# Altium schematic sheet 3轴5.2-原理图-V3.3-2023.10.27.SchDoc
size A2
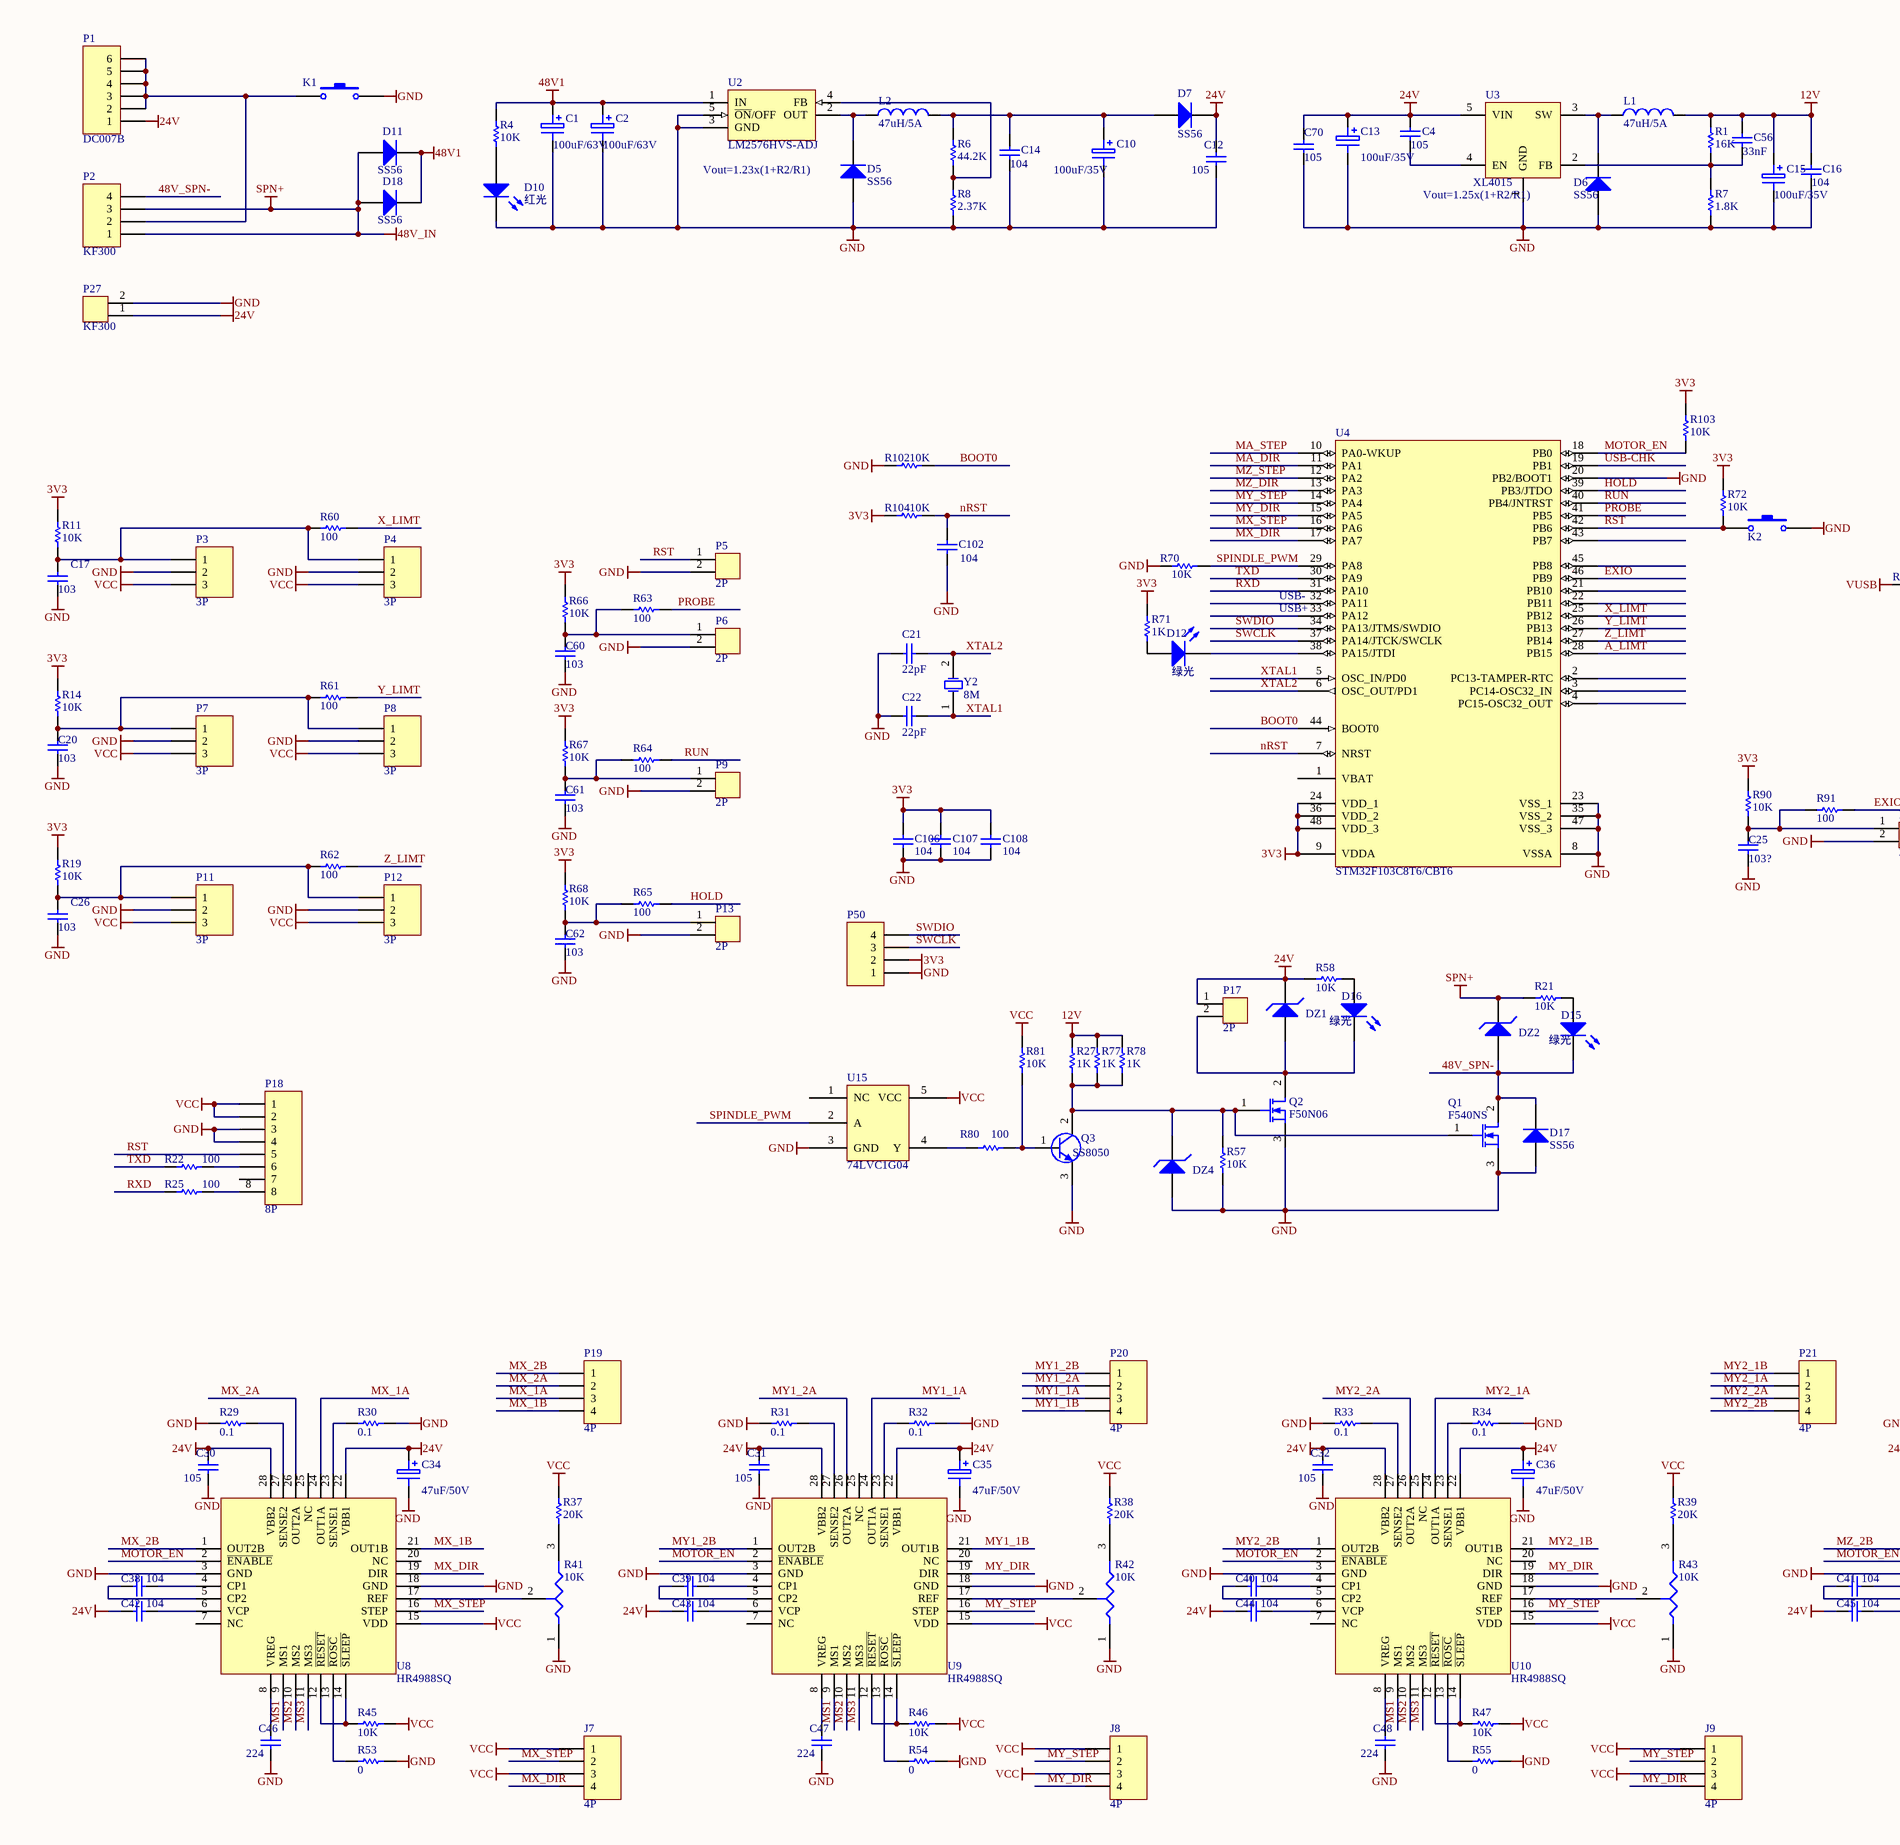
[diagram p0: 3轴5.2-原理图-V3.3-2023.10.27.SchDoc, left]
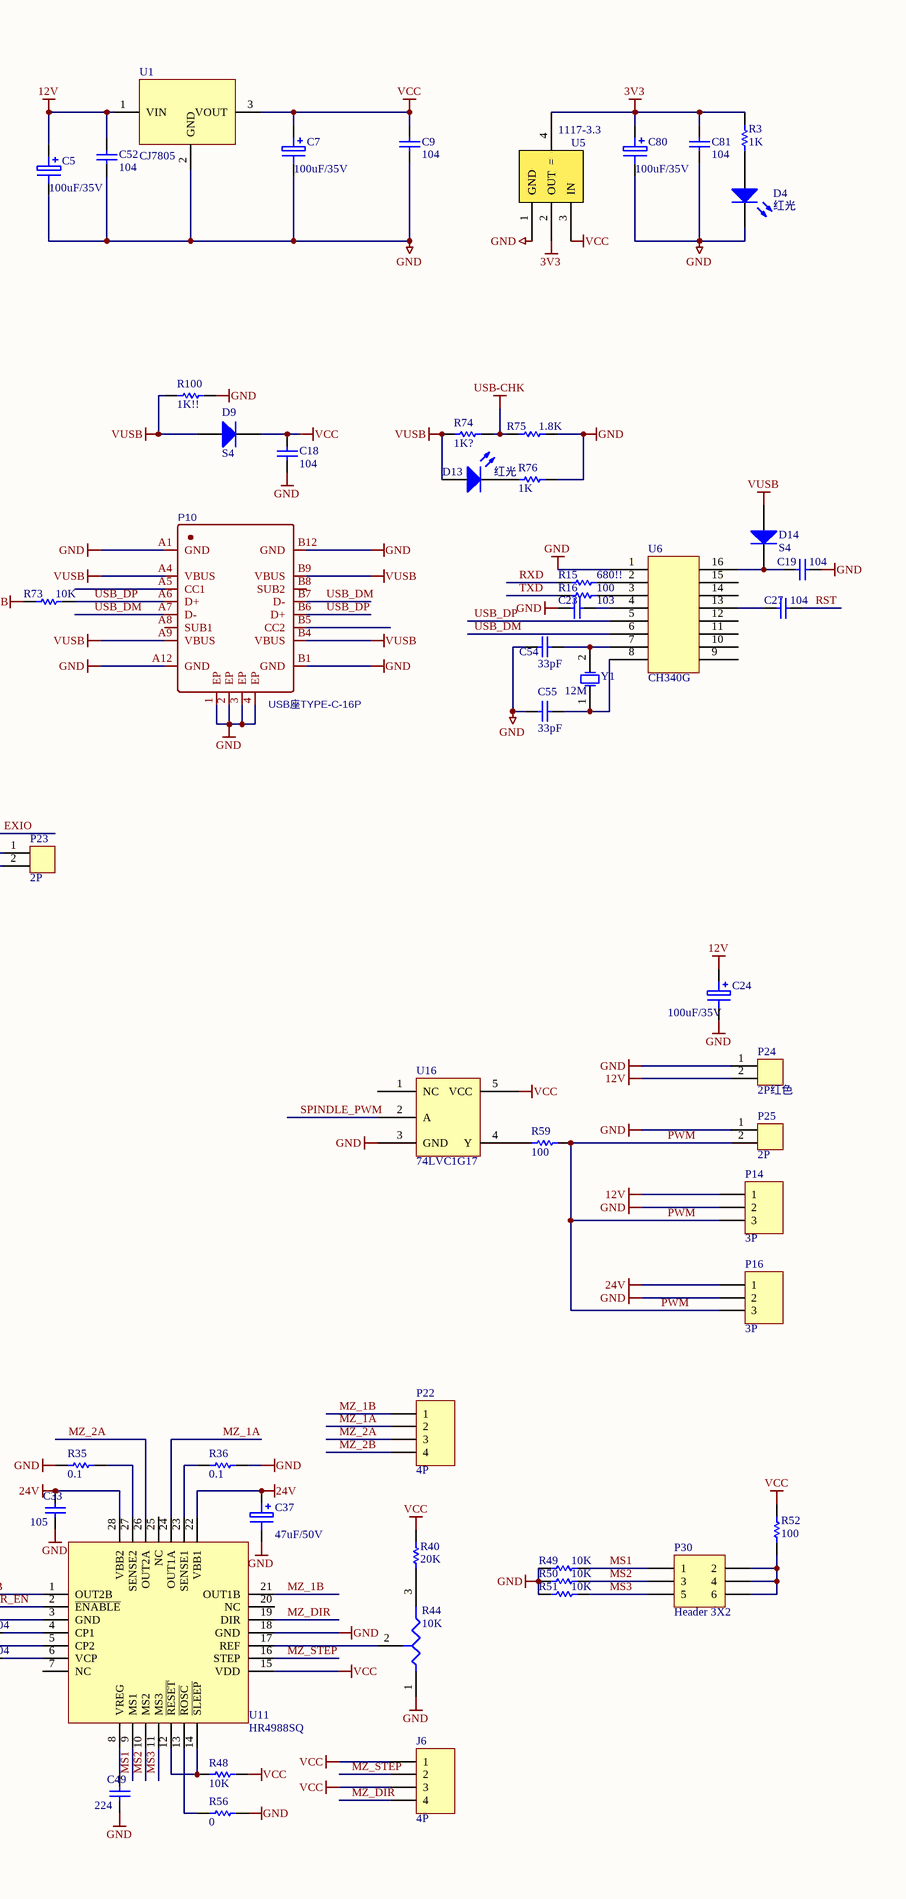
[diagram p1: 3轴5.2-原理图-V3.3-2023.10.27.SchDoc, right]

## Parts
C1  100uF/63V  [电解电容贴片10x10]
C2  100uF/63V  [电解电容贴片10x10]
C4  105  [0805C]
C5  100uF/35V  [电解电容贴片6x6]
C7  100uF/35V  [电解电容贴片6x6]
C9  104  [0603C]
C10  100uF/35V  [电解电容贴片6x6]
C12  105  [0805C]
C13  100uF/35V  [电解电容贴片6x6]
C14  104  [0603C]
C15  100uF/35V  [电解电容贴片6x6]
C16  104  [0603C]
C17  103  [0603C]
C18  104  [0603C]
C19  104  [0603C]
C20  103  [0603C]
C21  22pF  [0603C]
C22  22pF  [0603C]
C23  103  [0603C]
C24  100uF/35V  [电解电容贴片6x6]
C25  103?  [0603C]
C26  103  [0603C]
C27  104  [0603C]
C30  105  [0805C]
C31  105  [0805C]
C32  105  [0805C]
C33  105  [0805C]
C34  47uF/50V  [电解电容贴片6x6]
C35  47uF/50V  [电解电容贴片6x6]
C36  47uF/50V  [电解电容贴片6x6]
C37  47uF/50V  [电解电容贴片6x6]
C38  104  [0603C]
C39  104  [0603C]
C40  104  [0603C]
C41  104  [0603C]
C42  104  [0603C]
C43  104  [0603C]
C44  104  [0603C]
C45  104  [0603C]
C46  224  [0603C]
C47  224  [0603C]
C48  224  [0603C]
C49  224  [0603C]
C52  104  [0603C]
C54  33pF  [0603C]
C55  33pF  [0603C]
C56  33nF  [0603C]
C60  103  [0603C]
C61  103  [0603C]
C62  103  [0603C]
C70  105  [0805C]
C80  100uF/35V  [电解电容贴片6x6]
C81  104  [0603C]
C102  104  [0603C]
C106  104  [0603C]
C107  104  [0603C]
C108  104  [0603C]
D4  红光  [0603LED]
D5  SS56  [SMA]
D6  SS56  [SMA]
D7  SS56  [SMA]
D9  S4  [SOD-123]
D10  红光  [0603LED]
D11  SS56  [SMA]
D12  绿光  [0603LED]
D13  红光  [0603LED]
D14  S4  [SOD-123]
D15  绿光  [0603LED]
D16  绿光  [0603LED]
D17  SS56  [SMA]
D18  SS56  [SMA]
DZ1  快恢复二极管RS2M  [SMC]  (value not drawn)
DZ2  快恢复二极管RS2M  [SMC]  (value not drawn)
DZ4  稳压二极管SMAZ10V  [SMA]  (value not drawn)
J6  4P  [SIP4]
J7  4P  [SIP4]
J8  4P  [SIP4]
J9  4P  [SIP4]
K1  按键  [船型开关KCD1-101]  (value not drawn)
K2  按键  [按键6x6贴片]  (value not drawn)
L1  47uH/5A  [电感贴片12x12]
L2  47uH/5A  [电感贴片12x12]
P1  DC007B  [DC007B]
P2  KF300  [直插座4P-KF300]
P3  3P  [HDR1X3_CON]
P4  3P  [HDR1X3_CON]
P5  2P  [HDR1X2_CON]
P6  2P  [HDR1X2_CON]
P7  3P  [HDR1X3_CON]
P8  3P  [HDR1X3_CON]
P9  2P  [HDR1X2_CON]
P10  USB座TYPE-C-16P  [USB-TYPE-C-16P]
P11  3P  [HDR1X3_CON]
P12  3P  [HDR1X3_CON]
P13  2P  [HDR1X2_CON]
P14  3P  [HDR1X3_CON]
P16  3P  [HDR1X3_CON]
P17  2P  [VH3.96-2P直插座]
P18  8P  [IDC8]
P19  4P  [HDR1X4_CON]
P20  4P  [HDR1X4_CON]
P21  4P  [HDR1X4_CON]
P22  4P  [HDR1X4_CON]
P23  2P  [HDR1X2_CON]
P24  2P红色  [HDR1X2_CON]
P25  2P  [HDR1X2_CON]
P27  KF300  [直插座2P-KF300]
P30  Header 3X2  [HDR2X3]
P50  (no value)  [SIP4]
Q1  F540NS  [TO-263-2]
Q2  F50N06  [TO-252]
Q3  SS8050  [SOT-23]
R1  16K  [0603R]
R3  1K  [0603R]
R4  10K  [0603R]
R6  44.2K  [0603R]
R7  1.8K  [0603R]
R8  2.37K  [0603R]
R11  10K  [0603R]
R14  10K  [0603R]
R15  680!!  [0603R]
R16  100  [0603R]
R19  10K  [0603R]
R21  10K  [0603R]
R22  100  [0603R]
R25  100  [0603R]
R27  1K  [0603R]
R29  0.1  [0805R]
R30  0.1  [0805R]
R31  0.1  [0805R]
R32  0.1  [0805R]
R33  0.1  [0805R]
R34  0.1  [0805R]
R35  0.1  [0805R]
R36  0.1  [0805R]
R37  20K  [0603R]
R38  20K  [0603R]
R39  20K  [0603R]
R40  20K  [0603R]
R41  10K  [松下贴片电位器3x3]
R42  10K  [松下贴片电位器3x3]
R43  10K  [松下贴片电位器3x3]
R44  10K  [松下贴片电位器3x3]
R45  10K  [0603R]
R46  10K  [0603R]
R47  10K  [0603R]
R48  10K  [0603R]
R49  10K  [0603R]
R50  10K  [0603R]
R51  10K  [0603R]
R52  100  [0603R]
R53  0  [0603R]
R54  0  [0603R]
R55  0  [0603R]
R56  0  [0603R]
R57  10K  [0603R]
R58  10K  [0603R]
R59  100  [0603R]
R60  100  [0603R]
R61  100  [0603R]
R62  100  [0603R]
R63  100  [0603R]
R64  100  [0603R]
R65  100  [0603R]
R66  10K  [0603R]
R67  10K  [0603R]
R68  10K  [0603R]
R70  10K  [0603R]
R71  1K  [0603R]
R72  10K  [0603R]
R73  10K  [0603R]
R74  1K?  [0603R]
R75  1.8K  [0603R]
R76  1K  [0603R]
R77  1K  [0603R]
R78  1K  [0603R]
R80  100  [0603R]
R81  10K  [0603R]
R90  10K  [0603R]
R91  100  [0603R]
R100  1K!!  [0603R]
R102  10k  [0603R]
R103  value 10K  [0603R]
R104  10k  [0603R]
U1  CJ7805  [TO-263-2]
U2  LM2576HVS-ADJ  [TO-263]
U3  XL4015  [TO-263]
U4  STM32F103C8T6/CBT6  [LQFP48]
U5  1117-3.3  [SOT-223]
U6  CH340G  [SOP16]
U8  HR4988SQ  [QFN28]
U9  HR4988SQ  [QFN28]
U10  HR4988SQ  [QFN28]
U11  HR4988SQ  [QFN28]
U15  74LVC1G04  [SOT-23-5]
U16  74LVC1G17  [SOT-23-5]
Y1  12M  [晶振贴片49SSMD]
Y2  8M  [晶振贴片]

## Nets
3V3: C80.1 C81.2 C106.2 C107.2 C108.2 P50.2 R3.1 R11.2 R14.2 R19.2 R66.2 R67.2 R68.2 R71.2 R72.1 R90.2 R103.2 R104.1 U4.9(VDDA) U4.24(VDD_1) U4.36(VDD_2) U4.48(VDD_3) U5.2(OUT) U5.4(=)
12V: C5.1 C15.1 C16.2 C24.1 C52.2 C56.2 L1.2 P14.1 P24.2 R1.2 R27.2 R77.2 R78.2 U1.1(VIN)
24V: C4.2 C12.1 C13.1 C30.1 C31.1 C32.1 C33.1 C34.1 C35.1 C36.1 C37.1 C42.2 C43.2 C44.2 C45.2 C70.1 D7.2 DZ1.2 P1.1 P16.1 P17.1 P27.1 R58.1 U3.5(VIN) U8.22(VBB1) U8.28(VBB2) U9.22(VBB1) U9.28(VBB2) U10.22(VBB1) U10.28(VBB2) U11.22(VBB1) U11.28(VBB2)
48V1: C1.1 C2.1 D11.2 D18.2 R4.2 U2.1(IN)
48V_IN: D11.1 D18.1 DZ2.2 P2.1 P2.3 R21.1  [also labelled SPN+]
GND: C1.2 C2.2 C5.2 C7.2 C9.1 C10.2 C12.2 C13.2 C14.1 C15.2 C16.1 C17.1 C18.1 C19.1 C20.1 C21.2 C22.2 C23.2 C24.2 C25.1 C26.1 C30.2 C31.2 C32.2 C33.2 C34.2 C35.2 C36.2 C37.2 C46.2 C47.2 C48.2 C49.2 C52.1 C54.2 C55.2 C60.1 C61.1 C62.1 C70.2 C80.2 C81.1 C102.1 C106.1 C107.1 C108.1 D4.2 D5.1 D6.1 D10.2 D17.1 DZ4.1 K1.2 K2.2 P3.2 P4.2 P5.2 P6.2 P7.2 P8.2 P9.2 P10.1(EP) P10.2(EP) P10.3(EP) P10.4(EP) P10.A1(GND) P10.A12(GND) P10.B1(GND) P10.B12(GND) P11.2 P12.2 P13.2 P14.2 P16.2 P18.3 P18.4 P23.2 P24.1 P25.1 P27.2 P50.1 Q1.3(S) Q2.3(S) Q3.3(E) R7.1 R8.1 R29.2 R30.1 R31.2 R32.1 R33.2 R34.1 R35.2 R36.1 R41.1(A) R42.1(A) R43.1(A) R44.1(A) R49.2 R50.2 R51.2 R53.1 R54.1 R55.1 R56.1 R57.2 R70.1 R75.2 R76.1 R100.1 R102.1 U1.2(GND) U2.3(GND) U2.5(~{ON}/OFF) U3.1(GND) U4.8(VSSA) U4.20(PB2/BOOT1) U4.23(VSS_1) U4.35(VSS_2) U4.47(VSS_3) U5.1(GND) U6.1 U8.3(GND) U8.18(GND) U9.3(GND) U9.18(GND) U10.3(GND) U10.18(GND) U11.3(GND) U11.18(GND) U15.3(GND) U16.3(GND)
USB-CHK: R74.2 R75.1 U4.19(PB1)
VCC: C7.1 C9.2 C18.2 D9.2 J6.1 J6.3 J7.1 J7.3 J8.1 J8.3 J9.1 J9.3 P3.3 P4.3 P7.3 P8.3 P11.3 P12.3 P18.1 P18.2 R37.2 R38.2 R39.2 R40.2 R45.1 R46.1 R47.1 R48.1 R52.1 R81.2 U1.3(VOUT) U5.3(IN) U8.15(VDD) U9.15(VDD) U10.15(VDD) U11.15(VDD) U15.5(VCC) U16.5(VCC)
VUSB: D9.1 D13.1 D14.1 P10.A4(VBUS) P10.A9(VBUS) P10.B4(VBUS) P10.B9(VBUS) R73.1 R74.1 R100.2
48V_SPN-: D15.2 D17.2 DZ2.1 P2.4 Q1.2(D)
A_LIMT: U4.28(PB15)
BOOT0: R102.2 U4.44(BOOT0)
EXIO: R91.1 U4.46(PB9)
HOLD: R65.1 U4.39(PB3/JTDO)
MA_DIR: U4.11(PA1)
MA_STEP: U4.10(PA0-WKUP)
MOTOR_EN: R103.1 U4.18(PB0) U8.2(~{ENABLE}) U9.2(~{ENABLE}) U10.2(~{ENABLE}) U11.2(~{ENABLE})
MS1: P30.1 R49.1 U8.9(MS1) U9.9(MS1) U10.9(MS1) U11.9(MS1)
MS2: P30.3 R50.1 U8.10(MS2) U9.10(MS2) U10.10(MS2) U11.10(MS2)
MS3: P30.5 R51.1 U8.11(MS3) U9.11(MS3) U10.11(MS3) U11.11(MS3)
MX_1A: P19.3 U8.24(OUT1A)
MX_1B: P19.4 U8.21(OUT1B)
MX_2A: P19.2 U8.26(OUT2A)
MX_2B: P19.1 U8.1(OUT2B)
MX_DIR: J7.4 U4.17(PA7) U8.19(DIR)
MX_STEP: J7.2 U4.16(PA6) U8.16(STEP)
MY1_1A: P20.3 U9.24(OUT1A)
MY1_1B: P20.4 U9.21(OUT1B)
MY1_2A: P20.2 U9.26(OUT2A)
MY1_2B: P20.1 U9.1(OUT2B)
MY2_1A: P21.2 U10.24(OUT1A)
MY2_1B: P21.1 U10.21(OUT1B)
MY2_2A: P21.3 U10.26(OUT2A)
MY2_2B: P21.4 U10.1(OUT2B)
MY_DIR: J8.4 J9.4 U4.15(PA5) U9.19(DIR) U10.19(DIR)
MY_STEP: J8.2 J9.2 U4.14(PA4) U9.16(STEP) U10.16(STEP)
MZ_1A: P22.2 U11.24(OUT1A)
MZ_1B: P22.1 U11.21(OUT1B)
MZ_2A: P22.3 U11.26(OUT2A)
MZ_2B: P22.4 U11.1(OUT2B)
MZ_DIR: J6.4 U4.13(PA3) U11.19(DIR)
MZ_STEP: J6.2 U4.12(PA2) U11.16(STEP)
nRST: C102.2 R104.2 U4.7(NRST)
PROBE: R63.1 U4.41(PB5)
PWM: P14.3 P16.3 P25.2 R59.2
RST: C27.2 K2.1 P5.1 P18.5 R72.2 U4.42(PB6)
RUN: R64.1 U4.40(PB4/JNTRST)
RXD: R15.2 R25.1 U4.31(PA10)
SPINDLE_PWM: R70.2 U4.29(PA8) U15.2(A) U16.2(A)
SWCLK: P50.3 U4.37(PA14/JTCK/SWCLK)
SWDIO: P50.4 U4.34(PA13/JTMS/SWDIO)
TXD: R16.2 R22.1 U4.30(PA9)
USB_DM: P10.A7(D-) P10.B7(D-) U6.6
USB_DP: P10.A6(D+) P10.B6(D+) R73.2 U6.5
X_LIMT: R60.1 U4.25(PB12)
XTAL1: C22.1 U4.5(OSC_IN/PD0) Y2.1(OSC1)
XTAL2: C21.1 U4.6(OSC_OUT/PD1) Y2.2(OSC2)
Y_LIMT: R61.1 U4.26(PB13)
Z_LIMT: R62.1 U4.27(PB14)
NetC4_1: C4.1 U3.4(EN)
NetC10_1: C10.1 C14.2 D7.1 L2.2 R6.2
NetC17_2: C17.2 P3.1 P4.1 R11.1 R60.2
NetC19_2: C19.2 D14.2 U6.16
NetC20_2: C20.2 P7.1 P8.1 R14.1 R61.2
NetC23_1: C23.1 U6.4
NetC25_2: C25.2 P23.1 R90.1 R91.2
NetC26_2: C26.2 P11.1 P12.1 R19.1 R62.2
NetC27_1: C27.1 U6.13
NetC38_1: C38.1 U8.4(CP1)
NetC38_2: C38.2 U8.5(CP2)
NetC39_1: C39.1 U9.4(CP1)
NetC39_2: C39.2 U9.5(CP2)
NetC40_1: C40.1 U10.4(CP1)
NetC40_2: C40.2 U10.5(CP2)
NetC41_1: C41.1 U11.4(CP1)
NetC41_2: C41.2 U11.5(CP2)
NetC42_1: C42.1 U8.6(VCP)
NetC43_1: C43.1 U9.6(VCP)
NetC44_1: C44.1 U10.6(VCP)
NetC45_1: C45.1 U11.6(VCP)
NetC46_1: C46.1 U8.8(VREG)
NetC47_1: C47.1 U9.8(VREG)
NetC48_1: C48.1 U10.8(VREG)
NetC49_1: C49.1 U11.8(VREG)
NetC54_1: C54.1 U6.7 Y1.2(OSC2)
NetC55_1: C55.1 U6.8 Y1.1(OSC1)
NetC56_1: C56.1 R1.1 R7.2 U3.2(FB)
NetC60_2: C60.2 P6.1 R63.2 R66.1
NetC61_2: C61.2 P9.1 R64.2 R67.1
NetC62_2: C62.2 P13.1 R65.2 R68.1
NetD4_1: D4.1 R3.2
NetD5_2: D5.2 L2.1 U2.2(OUT)
NetD6_2: D6.2 L1.1 U3.3(SW)
NetD10_1: D10.1 R4.1
NetD12_1: D12.1 R71.1
NetD12_2: D12.2 U4.38(PA15/JTDI)
NetD13_2: D13.2 R76.2
NetD15_1: D15.1 R21.2
NetD16_1: D16.1 R58.2
NetD16_2: D16.2 DZ1.1 P17.2 Q2.2(D)
NetDZ4_2: DZ4.2 Q1.1(G) Q2.1(G) Q3.2(C) R27.1 R57.1 R77.1 R78.1
NetK1_1: K1.1 P1.2 P1.3 P1.4 P1.5 P1.6 P2.2
NetP18_6: P18.6 R22.2
NetP18_8: P18.8 R25.2
NetP30_2: P30.2 P30.4 P30.6 R52.2
NetQ3_1: Q3.1(B) R80.2 R81.1
NetR6_1: R6.1 R8.2 U2.4(FB)
NetR15_1: R15.1 U6.2
NetR16_1: R16.1 U6.3
NetR29_1: R29.1 U8.27(SENSE2)
NetR30_2: R30.2 U8.23(SENSE1)
NetR31_1: R31.1 U9.27(SENSE2)
NetR32_2: R32.2 U9.23(SENSE1)
NetR33_1: R33.1 U10.27(SENSE2)
NetR34_2: R34.2 U10.23(SENSE1)
NetR35_1: R35.1 U11.27(SENSE2)
NetR36_2: R36.2 U11.23(SENSE1)
NetR37_1: R37.1 R41.3(B)
NetR38_1: R38.1 R42.3(B)
NetR39_1: R39.1 R43.3(B)
NetR40_1: R40.1 R44.3(B)
NetR41_2: R41.2(TAP) U8.17(REF)
NetR42_2: R42.2(TAP) U9.17(REF)
NetR43_2: R43.2(TAP) U10.17(REF)
NetR44_2: R44.2(TAP) U11.17(REF)
NetR45_2: R45.2 U8.12(~{RESET}) U8.14(~{SLEEP})
NetR46_2: R46.2 U9.12(~{RESET}) U9.14(~{SLEEP})
NetR47_2: R47.2 U10.12(~{RESET}) U10.14(~{SLEEP})
NetR48_2: R48.2 U11.12(~{RESET}) U11.14(~{SLEEP})
NetR53_2: R53.2 U8.13(~{ROSC})
NetR54_2: R54.2 U9.13(~{ROSC})
NetR55_2: R55.2 U10.13(~{ROSC})
NetR56_2: R56.2 U11.13(~{ROSC})
NetR59_1: R59.1 U16.4(Y)
NetR80_1: R80.1 U15.4(Y)

Not connected (* = marked no-connect by the designer): P10 A5(CC1) A8(SUB1) B5(CC2) B8(SUB2); P18 7; U4 1(VBAT) 2(PC13-TAMPER-RTC) 3(PC14-OSC32_IN) 4(PC15-OSC32_OUT) 21(PB10) 22(PB11) 32(PA11) 33(PA12) 43(PB7) 45(PB8); U6 9 10 11 12 14 15; U8 7(NC) 20(NC) 25(NC); U9 7(NC) 20(NC) 25(NC); U10 7(NC) 20(NC) 25(NC); U11 7(NC) 20(NC) 25(NC); U15 1(NC); U16 1(NC)

## Notes on the sheet
- Vout=1.23x(1+R2/R1)
- (near U3) Vout=1.25x(1+R2/R1)
- (near U4) USB-
- (near U4) USB+

## Library data of the parts
C1 C2 C5 C7 C10 C13 C15 C24 C34-C37 C80 = ELECTRO1
C4 C12 C14 C16 C17 C20 C25 C26 C30-C33 C38-C49 C56 C60-C62 C70 C106-C108 = CAP
  C106-C108: value: 104
C9 C18 C19 C23 C27 C52 C81 C102 = Cap Semi: Capacitor (Semiconductor SIM Model); Published: 8-Jun-2000; LatestRevisionDate: 17-Jul-2002; LatestRevisionNote: Re-released for DXP Platform.; PackageReference: C1206; Publisher: Altium Limited
  C9 C18 C19 C27 C52 C81: Value: 104
C21 C22 = Cap Semi: Capacitor (Semiconductor SIM Model); Value: 100pF; Published: 8-Jun-2000; LatestRevisionDate: 17-Jul-2002; LatestRevisionNote: Re-released for DXP Platform.; PackageReference: C1206; Publisher: Altium Limited
C54 C55 = Cap Semi: Capacitor (Semiconductor SIM Model); Value: 18pF; Published: 8-Jun-2000; LatestRevisionDate: 17-Jul-2002; LatestRevisionNote: Re-released for DXP Platform.; PackageReference: C1206; Publisher: Altium Limited
D4 D10 D12 D13 D15 D16 = LED
D5-D7 D9 D11 D14 D17 D18 = 1N4148
DZ1 DZ2 DZ4 = 稳压二极管
L1 L2 = Inductor: Code_IEC: 1005; Published: 8-Jun-2000; LatestRevisionDate: 29-May-2009; LatestRevisionNote: IPC-7351 Footprint Added.; PackageReference: 0402-A; Publisher: Altium Limited; PackageDescription: Chip Inductor; Code_JEITA: 0402
P1 = 6P
P2 P50 = 4P
P10 = USB座TYPE-C-16P: BOM_Manufacturer: Shenzhen Kinghelm Elec; BOM_Manufacturer Part: KH-TYPE-C-16P-T; Contributor: LCSC; BOM_Supplier: LCSC; BOM_Supplier Part: C709358; spicePre: U; spiceSymbolName: KH-TYPE-C-16P-T
P24 P27 = 2P
P30 = Header 3X2: Header, 3-Pin, Dual row; LatestRevisionDate: 17-Jul-2002; LatestRevisionNote: Re-released for DXP Platform.; Publisher: Altium Limited
Q1 Q2 = MOSFET-N: N-Channel MOSFET; Published: 8-Jun-2000; LatestRevisionDate: 17-Jul-2002; LatestRevisionNote: Re-released for DXP Platform.; PackageVersion: 1995/1996; PackageReference: E3; Publisher: Altium Limited
Q3 = NPN: Published: 8-Jun-2000; LatestRevisionDate: 17-Jul-2002; LatestRevisionNote: Re-released for DXP Platform.; PackageReference: TO-226; Publisher: Altium Limited; Code_JEDEC: TO-226-AA
R1 R3 R4 R6-R8 R11 R14-R16 R19 R21 R22 R25 R27 R29-R40 R45-R68 R70-R78 R80 R81 R90 R91 R100 R102-R104 = RES: Resistor; Published: 8-Jun-2000; LatestRevisionDate: 17-Jul-2002; LatestRevisionNote: Re-released for DXP Platform.; PackageReference: AXIAL-0.3; Publisher: Altium Limited
  R102 R104: Value: 10K
R41-R44 = 电位器
U1 = 7805
U2 = LM2576S-5.0: Simple Switcher 3A Step Down Voltage Regulator; Note: Tab is connected to GND; Published: 15-Apr-2002; DatasheetVersion: Jun-1999; PackageReference: TS5B; Publisher: Altium Limited; PackageDescription: D2-PAK; 5 Leads; Body 14.4 (inc. leads) x 10.4 mm (LxW max); ComponentLink1Description: Manufacturer Link; ComponentLink1URL: http://www.national.com/; ComponentLink2Description: Datasheet; ComponentLink2URL: http://www.national.com/ds.cgi/LM/LM2576.pdf; ComponentLink3Description: URL Link1; ComponentLink3URL: http://www.national.com/pf/LM/LM2576.html
U3 = XL4005
U4 = STM32F103C6T6: STM32 ARM-based 32-bit MCU with 32 Kbytes Flash, 48-pin LQFP, Industrial Temperature; Published: *; DatasheetVersion: *; PackageVersion: *; PackageReference: *; Publisher: *; PackageDescription: *; ComponentLink1Description: *; ComponentLink1URL: *; ComponentLink2Description: *; ComponentLink2URL: *
U5 = LM1117
U6 = DIP16
U8-U11 = HR4988
U15 = 74LVC1G17
Y1 Y2 = XTAL: Crystal Oscillator; Published: 8-Jun-2000; LatestRevisionDate: 17-Jul-2002; LatestRevisionNote: Re-released for DXP Platform.; PackageReference: R38; Publisher: Altium Limited